# Altium schematic sheet NB3000_AL_Cached_Sdram.SchDoc
size A3
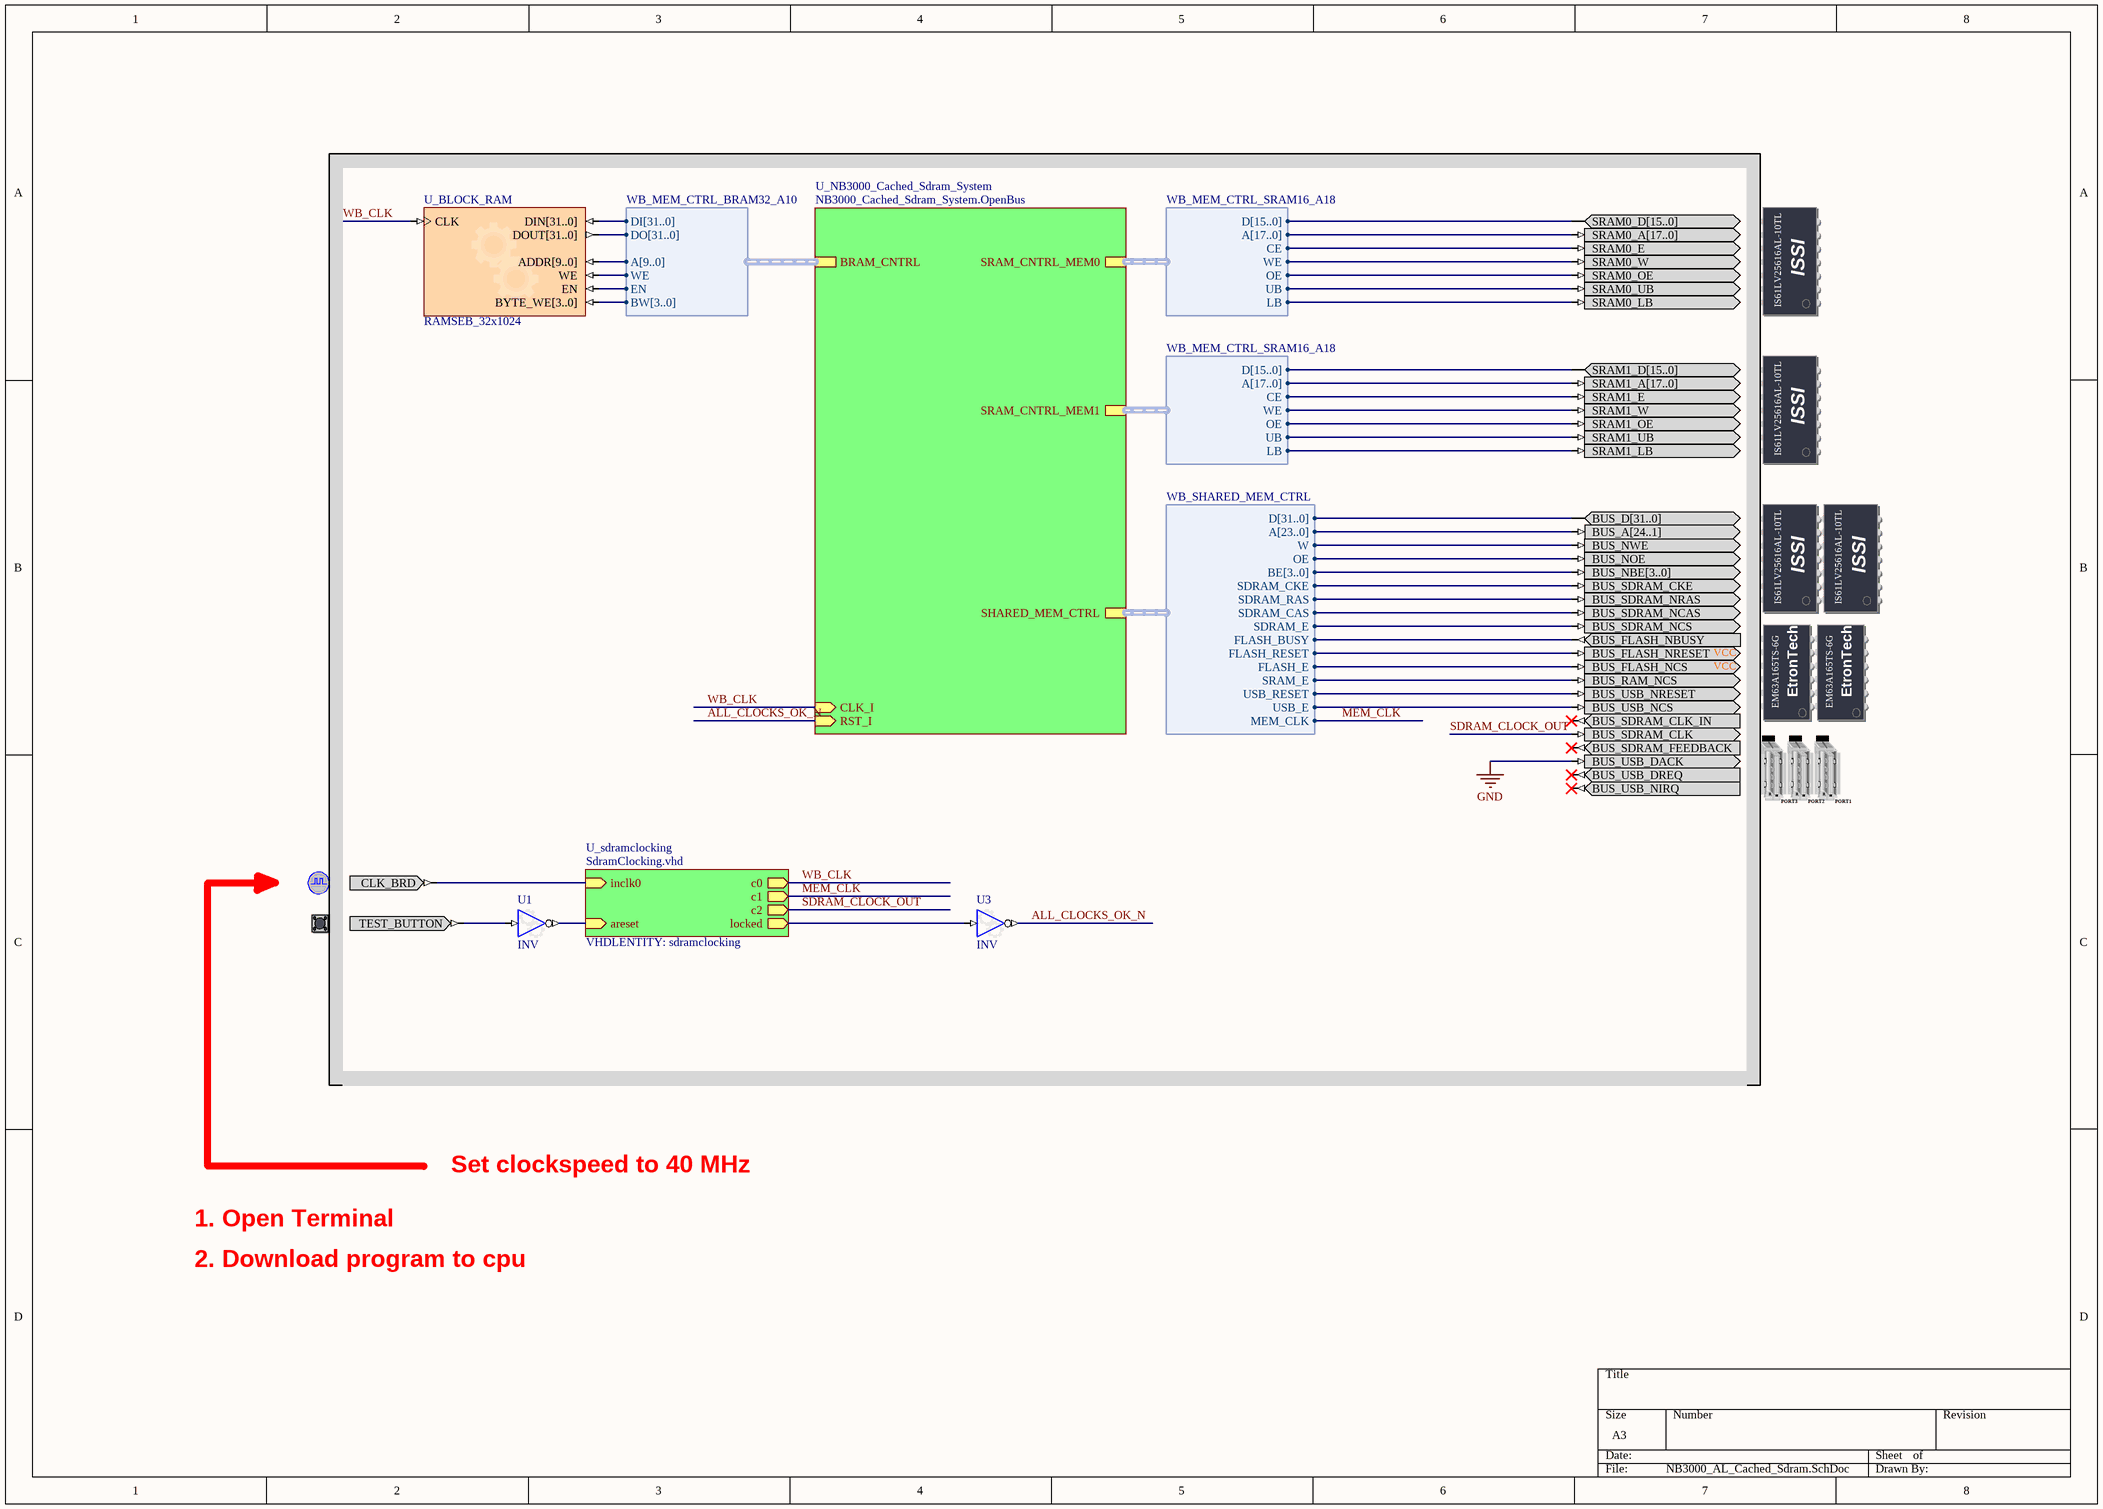
[diagram p0: NB3000_AL_Cached_Sdram.SchDoc]

## Parts
(Parts that share a designator on the sheet are numbered #1, #2 ... from top to bottom, then left to right.)
?#1  SRAM0  (value not drawn)
?#2  SRAM1  (value not drawn)
?#3  SHARED_SRAM_SDRAM_USB  (value not drawn)
?#4  CLOCK_BOARD  (value not drawn)
?#5  TEST_BUTTON  (value not drawn)
U1  INV
U3  INV
U_BLOCK_RAM  RAMSEB_32x1024

## Sub-sheets
U_NB3000_Cached_Sdram_System = NB3000_Cached_Sdram_System.OpenBus: BRAM_CNTRL (harness WB_MEM_CTRL_BRAM32_A10), SRAM_CNTRL_MEM0 (harness WB_MEM_CTRL_SRAM16_A18), SRAM_CNTRL_MEM1 (harness WB_MEM_CTRL_SRAM16_A18), SHARED_MEM_CTRL (harness WB_SHARED_MEM_CTRL), RST_I (in), CLK_I (in)
U_sdramclocking = SdramClocking.vhd: areset (in), c0 (out), c1 (out), c2 (out), inclk0 (in), locked (out)  | VHDLENTITY: sdramclocking

## Harnesses
WB_MEM_CTRL_SRAM16_A18: D[15..0], A[17..0], CE, WE, OE, UB, LB
WB_SHARED_MEM_CTRL: D[31..0], A[23..0], W, OE, BE[3..0], SDRAM_CKE, SDRAM_RAS, SDRAM_CAS, SDRAM_E, FLASH_BUSY, FLASH_RESET, FLASH_E, SRAM_E, USB_RESET, USB_E, MEM_CLK
WB_MEM_CTRL_BRAM32_A10: DI[31..0], DO[31..0], A[9..0], WE, EN, BW[3..0]

## Nets
GND: ?#3.BUS_USB_DACK
ALL_CLOCKS_OK_N: U3.O ; sheet U_NB3000_Cached_Sdram_System/RST_I
MEM_CLK: sheet U_sdramclocking/c1, sheet U_NB3000_Cached_Sdram_System/SHARED_MEM_CTRL.MEM_CLK
SDRAM_CLOCK_OUT: ?#3.BUS_SDRAM_CLK ; sheet U_sdramclocking/c2
WB_CLK: U_BLOCK_RAM.CLK ; sheet U_NB3000_Cached_Sdram_System/CLK_I, sheet U_sdramclocking/c0
Net?#1_SRAM0_A[17..0]: ?#1.SRAM0_A[17..0] ; sheet U_NB3000_Cached_Sdram_System/SRAM_CNTRL_MEM0.A[17..0]
Net?#1_SRAM0_D[15..0]: ?#1.SRAM0_D[15..0] ; sheet U_NB3000_Cached_Sdram_System/SRAM_CNTRL_MEM0.D[15..0]
Net?#1_SRAM0_E: ?#1.SRAM0_E ; sheet U_NB3000_Cached_Sdram_System/SRAM_CNTRL_MEM0.CE
Net?#1_SRAM0_LB: ?#1.SRAM0_LB ; sheet U_NB3000_Cached_Sdram_System/SRAM_CNTRL_MEM0.LB
Net?#1_SRAM0_OE: ?#1.SRAM0_OE ; sheet U_NB3000_Cached_Sdram_System/SRAM_CNTRL_MEM0.OE
Net?#1_SRAM0_UB: ?#1.SRAM0_UB ; sheet U_NB3000_Cached_Sdram_System/SRAM_CNTRL_MEM0.UB
Net?#1_SRAM0_W: ?#1.SRAM0_W ; sheet U_NB3000_Cached_Sdram_System/SRAM_CNTRL_MEM0.WE
Net?#2_SRAM1_A[17..0]: ?#2.SRAM1_A[17..0] ; sheet U_NB3000_Cached_Sdram_System/SRAM_CNTRL_MEM1.A[17..0]
Net?#2_SRAM1_D[15..0]: ?#2.SRAM1_D[15..0] ; sheet U_NB3000_Cached_Sdram_System/SRAM_CNTRL_MEM1.D[15..0]
Net?#2_SRAM1_E: ?#2.SRAM1_E ; sheet U_NB3000_Cached_Sdram_System/SRAM_CNTRL_MEM1.CE
Net?#2_SRAM1_LB: ?#2.SRAM1_LB ; sheet U_NB3000_Cached_Sdram_System/SRAM_CNTRL_MEM1.LB
Net?#2_SRAM1_OE: ?#2.SRAM1_OE ; sheet U_NB3000_Cached_Sdram_System/SRAM_CNTRL_MEM1.OE
Net?#2_SRAM1_UB: ?#2.SRAM1_UB ; sheet U_NB3000_Cached_Sdram_System/SRAM_CNTRL_MEM1.UB
Net?#2_SRAM1_W: ?#2.SRAM1_W ; sheet U_NB3000_Cached_Sdram_System/SRAM_CNTRL_MEM1.WE
Net?#3_BUS_A[24..1]: ?#3.BUS_A[24..1] ; sheet U_NB3000_Cached_Sdram_System/SHARED_MEM_CTRL.A[23..0]
Net?#3_BUS_D[31..0]: ?#3.BUS_D[31..0] ; sheet U_NB3000_Cached_Sdram_System/SHARED_MEM_CTRL.D[31..0]
Net?#3_BUS_FLASH_NBUSY: ?#3.BUS_FLASH_NBUSY ; sheet U_NB3000_Cached_Sdram_System/SHARED_MEM_CTRL.FLASH_BUSY
Net?#3_BUS_FLASH_NCS: ?#3.BUS_FLASH_NCS ; sheet U_NB3000_Cached_Sdram_System/SHARED_MEM_CTRL.FLASH_E
Net?#3_BUS_FLASH_NRESET: ?#3.BUS_FLASH_NRESET ; sheet U_NB3000_Cached_Sdram_System/SHARED_MEM_CTRL.FLASH_RESET
Net?#3_BUS_NBE[3..0]: ?#3.BUS_NBE[3..0] ; sheet U_NB3000_Cached_Sdram_System/SHARED_MEM_CTRL.BE[3..0]
Net?#3_BUS_NOE: ?#3.BUS_NOE ; sheet U_NB3000_Cached_Sdram_System/SHARED_MEM_CTRL.OE
Net?#3_BUS_NWE: ?#3.BUS_NWE ; sheet U_NB3000_Cached_Sdram_System/SHARED_MEM_CTRL.W
Net?#3_BUS_RAM_NCS: ?#3.BUS_RAM_NCS ; sheet U_NB3000_Cached_Sdram_System/SHARED_MEM_CTRL.SRAM_E
Net?#3_BUS_SDRAM_CKE: ?#3.BUS_SDRAM_CKE ; sheet U_NB3000_Cached_Sdram_System/SHARED_MEM_CTRL.SDRAM_CKE
Net?#3_BUS_SDRAM_NCAS: ?#3.BUS_SDRAM_NCAS ; sheet U_NB3000_Cached_Sdram_System/SHARED_MEM_CTRL.SDRAM_CAS
Net?#3_BUS_SDRAM_NCS: ?#3.BUS_SDRAM_NCS ; sheet U_NB3000_Cached_Sdram_System/SHARED_MEM_CTRL.SDRAM_E
Net?#3_BUS_SDRAM_NRAS: ?#3.BUS_SDRAM_NRAS ; sheet U_NB3000_Cached_Sdram_System/SHARED_MEM_CTRL.SDRAM_RAS
Net?#3_BUS_USB_NCS: ?#3.BUS_USB_NCS ; sheet U_NB3000_Cached_Sdram_System/SHARED_MEM_CTRL.USB_E
Net?#3_BUS_USB_NRESET: ?#3.BUS_USB_NRESET ; sheet U_NB3000_Cached_Sdram_System/SHARED_MEM_CTRL.USB_RESET
Net?#4_CLK_BRD: ?#4.CLK_BRD ; sheet U_sdramclocking/inclk0
Net?#5_TEST_BUTTON: ?#5.TEST_BUTTON U1.I
NetU1_O: U1.O ; sheet U_sdramclocking/areset
NetU3_I: U3.I ; sheet U_sdramclocking/locked
NetU_BLOCK_RAM_ADDR[9..0]: U_BLOCK_RAM.ADDR[9..0] ; sheet U_NB3000_Cached_Sdram_System/BRAM_CNTRL.A[9..0]
NetU_BLOCK_RAM_BYTE_WE[3..0]: U_BLOCK_RAM.BYTE_WE[3..0] ; sheet U_NB3000_Cached_Sdram_System/BRAM_CNTRL.BW[3..0]
NetU_BLOCK_RAM_DIN[31..0]: U_BLOCK_RAM.DIN[31..0] ; sheet U_NB3000_Cached_Sdram_System/BRAM_CNTRL.DI[31..0]
NetU_BLOCK_RAM_DOUT[31..0]: U_BLOCK_RAM.DOUT[31..0] ; sheet U_NB3000_Cached_Sdram_System/BRAM_CNTRL.DO[31..0]
NetU_BLOCK_RAM_EN: U_BLOCK_RAM.EN ; sheet U_NB3000_Cached_Sdram_System/BRAM_CNTRL.EN
NetU_BLOCK_RAM_WE: U_BLOCK_RAM.WE ; sheet U_NB3000_Cached_Sdram_System/BRAM_CNTRL.WE

Not connected (* = marked no-connect by the designer): ?#3 BUS_SDRAM_CLK_IN* BUS_SDRAM_FEEDBACK* BUS_USB_DREQ* BUS_USB_NIRQ*

## Notes on the sheet
- Set clockspeed to 40 MHz
- 1. Open Terminal
- 2. Download program to cpu
- (in symbol SHARED_SRAM_SDRAM_USB) ISSI; IS61LV25616AL-10TL; VCC; EtronTech; EM63A165TS-6G; USB2; PORT3; PORT2; PORT1
- (in symbol SRAM0) ISSI; IS61LV25616AL-10TL
- (in symbol SRAM1) ISSI; IS61LV25616AL-10TL

## Library data of the parts
?#1 = SRAM0: Free Static RAM - Daughterboard; PortComponent: True; Published: 14-May-2007; Publisher: Altium Limited; HelpURL: https://wiki.altium.com/display/ADOH/NanoBoard+3000+-+Independent+SRAM
?#2 = SRAM1: Free Static RAM - Daughterboard; PortComponent: True; Published: 14-May-2007; Publisher: Altium Limited; HelpURL: https://wiki.altium.com/display/ADOH/NanoBoard+3000+-+Independent+SRAM
?#3 = SHARED_SRAM_SDRAM_USB: Common-Bus SRAM SDRAM USB; PortComponent: True; Published: 14-May-2007; Publisher: Altium Limited; HelpURL: https://wiki.altium.com/display/ADOH/Accessing+Common-Bus+Resources+on+the+NanoBoard+3000
?#4 = CLOCK_BOARD: Global System Clock Supply; PortComponent: True; Published: 19-Nov-2003; Publisher: Altium Limited; HelpURL: https://wiki.altium.com/display/ADOH/NB2DSK01+-+System+Clocks; UseInDSF: True
?#5 = TEST_BUTTON: Test / Reset Button; PortComponent: True; Published: 19-Nov-2003; Publisher: Altium Limited; HelpURL: https://wiki.altium.com/display/ADOH/NB2DSK01+-+Daughter+Board+Test-Reset+Button
U1 U3 = INV: Configurable Inverter; ConfigurationParameters: {}Version[1.1]{}SignalCount[1]{}SignalWidth0[1]{}OutputOption0[Inverted]{}EnableMode[None]{}ShowPinNames[False]{}; ConfiguratorName: GENERIC_BUFFER; LastRevisionNo: 1.00.00; Published: 10-Oct-2008; Publisher: Altium Limited; HelpURL: https://wiki.altium.com/display/ADOH/Configurable+Generic+Library
U_BLOCK_RAM = MEMORY: Configurable Memory; ConfiguratorName: GENERIC_MEMORY; ConfigurationParameters: {}Version[1.0]{}Option_MemoryDepthText[1024]{}Option_MemoryWidth[32]{}Option_PortCount[0]{}Option_MemoryType[0]{}Option_ByteWrites[True]{}Option_RisingEdgeClock[True]{}Option_EnablePin[True]{}Option_ResetPin[False]{}Option_UseDistributed[False]{}Option_InitMemoryFlag[False]{}Option_MemoryFileName[ ]{}; LastRevisionNo: 1.00.00; Published: 28-Oct-2008; Publisher: Altium Limited; HelpURL: https://wiki.altium.com/display/ADOH/Configurable+Generic+Library